# Altium schematic sheet Sheet2.SchDoc
size A4; SheetNumber: 2; SheetTotal: 2
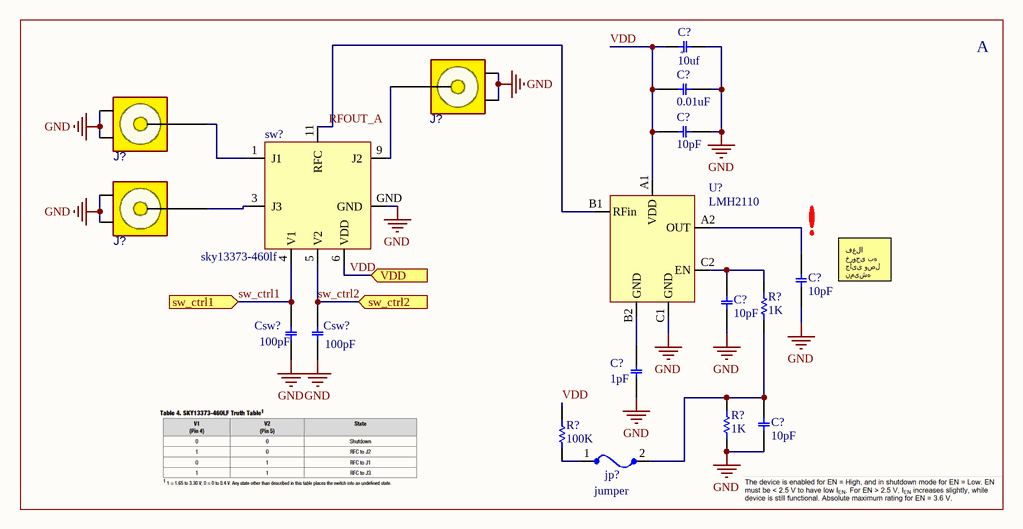
[diagram p0: Sheet2.SchDoc]

## Parts
(Parts that share a designator on the sheet are numbered #1, #2 ... from top to bottom, then left to right.)
C?#1  value 10uf  [CAPP 1206 (3216X18L) Size A]  (hidden comment: Capacitor Tantalum SMD)
C?#2  value 0.01uF  [C0402]  (hidden comment: Capacitor C SMD 0402)
C?#3  value 10pF  [C0402]  (hidden comment: Capacitor C SMD 0402)
C?#4  value 10pF  [C0402]  (hidden comment: Capacitor C SMD 0402)
C?#5  value 10pF  [C0402]  (hidden comment: Capacitor C SMD 0402)
C?#6  value 1pF  [C0402]  (hidden comment: Capacitor C SMD 0402)
C?#7  value 10pF  [C0402]  (hidden comment: Capacitor C SMD 0402)
Csw?#1  value 100pF  [C0402]  (hidden comment: Capacitor C SMD 0402)
Csw?#2  value 100pF  [C0402]  (hidden comment: Capacitor C SMD 0402)
J?#1  UFL  [UFL]  (value not drawn)
J?#2  UFL  [UFL]  (value not drawn)
J?#3  UFL  [UFL]  (value not drawn)
jp?  jumper  [RES 0402 (1005X04L)]
R?#1  value 1K  [SMD-0402-RES]  (hidden comment: Resistor SMD 0402)
R?#2  value 1K  [SMD-0402-RES]  (hidden comment: Resistor SMD 0402)
R?#3  value 100K  [SMD-0402-RES]  (hidden comment: Resistor SMD 0402)
sw?  sky13373-460lf  [QFN50P200X200X65-13N]
U?  LMH2110  [BGA6N40P3X2_124X84X67N]

## Blocks framed on the sheet
A: C?#1-C?#7 Csw?#1 Csw?#2 J?#1-J?#3 jp? R?#1-R?#3 sw? U?

## Ports
sw_ctrl1 (in), sw_ctrl2 (in), VDD (in)

## Nets
GND: C?#1.1 C?#2.2 C?#3.2 C?#4.1 C?#5.1 C?#6.1 C?#7.1 Csw?#1.1 Csw?#2.1 J?#1.2(G1) J?#1.3(G2) J?#2.2(G1) J?#2.3(G2) J?#3.2(G1) J?#3.3(G2) R?#2.1 sw?.GND U?.C1(GND)
RFOUT_A: sw?.11(RFC) U?.B1(RFin)
sw_ctrl1: Csw?#1.2 sw?.4(V1) ; port sw_ctrl1
sw_ctrl2: Csw?#2.2 sw?.5(V2) ; port sw_ctrl2
VDD: C?#1.2 C?#2.1 C?#3.1 R?#3.2 sw?.6(VDD) U?.A1(VDD) ; port VDD
NetC?#4_2: C?#4.2 U?.A2(OUT)
NetC?#5_2: C?#5.2 R?#1.2 U?.C2(EN)
NetC?#6_2: C?#6.2 U?.B2(GND)
NetC?#7_2: C?#7.2 jp?.2 R?#1.1 R?#2.2
NetJ?#1_1: J?#1.1(SIG) sw?.9(J2)
NetJ?#2_1: J?#2.1(SIG) sw?.1(J1)
NetJ?#3_1: J?#3.1(SIG) sw?.3(J3)
Netjp?_1: jp?.1 R?#3.1

## Notes on the sheet
- (near C?#4) فعلا خروجی به جایی وصل نمیشه
- (in symbol Capacitor Tantalum SMD) +

## Library data of the parts
C?#1 = Capacitor Tantalum SMD: Designed by:: MJKhodami
C?#2-C?#7 Csw?#1 Csw?#2 = Capacitor C SMD 0402: Designed by:: MJKhodami
J?#1-J?#3 = RF UFL: CONN, RF, U.FL, STRAIGHT, Ultra Miniature Coaxial; Designed by:: MJKhodami; ComponentLink1Description: Our Website:; ComponentLink1URL: https://www.spaceomid.com/
R?#1-R?#3 = Resistor SMD 0402: Designed by:: MJKhodami
sw? = sky13373-460lf: Broadband frequency range: 0.1 to 8.0 GHz / • Low insertion loss: 0.45 dB @ 2.5 GHz, 0.65 dB @ 7.125 GHz / • High isolation: 30 dB up to 2.5 GHz / • No external DC blocking capacitors required / • Positive low voltage control: VCTL = 1.65 to 3.00 V, / VDD = 2.5 to 4.8 V / • Small, QFN (12-pin, 2 x 2 mm) package / (MSL1, 260 °C per JEDEC J-STD-020)
U? = LMH2110: - Wide Supply Range from 2.7 V to 5 V / - Logarithmic Root Mean Square Response